# Altium schematic sheet BrauV2_Buzzer.SchDoc
size 420 x 297 mm; PageSetup: Record=PageOptions|CenterHorizontal=True|CenterVertical=True|PrintScale=1.01|XCorrection=1.00|YCorrection=1.00|PrintKind=1|BorderSize=5000000|LeftOffset=0|BottomOffset=0|Orientation=2|PaperLength=1000|PaperWidth=1000|Scale=100|PaperSource=7|PrintQuality=-4|MediaType=1|DitherType=10|PaperKind=A3|PrintScaleMode=1; DocumentNumber: 18; SheetNumber: 18; SheetTotal: 22
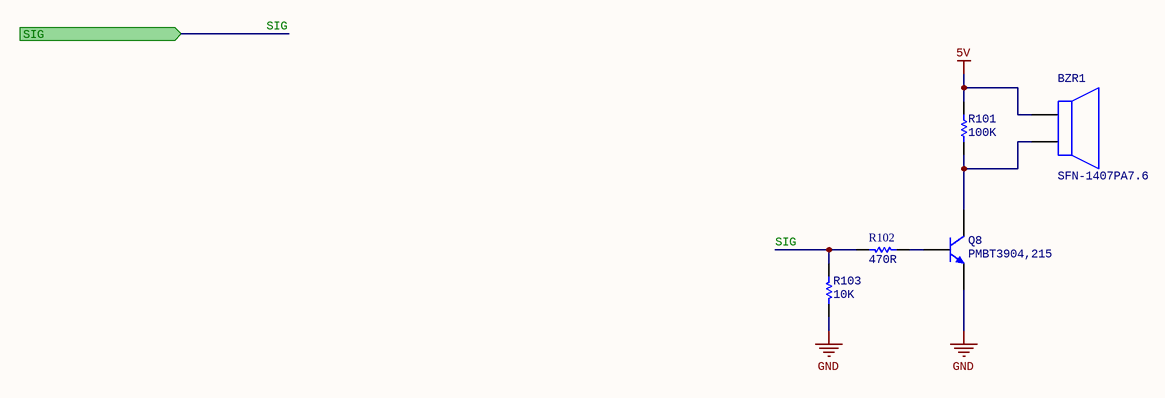
[diagram p0: BrauV2_Buzzer.SchDoc]

## Parts
BZR1  SFN-1407PA7.6  [SFN-1407PA7.6]
Q8  PMBT3904,215  [SOT23-3]
R101  Resistance: 100K  [SMD_RES_0402(1005)_N]  (hidden comment: RC0402FR-07100KL)
R102  Resistance: 470R  [SMD_RES_0402(1005)_N]  (hidden comment: RC0402FR-07470RL)
R103  Resistance: 10K  [SMD_RES_0402(1005)_N]  (hidden comment: RC0402FR-0710KL)

## Ports
SIG (in)

## Nets
5V: BZR1.1 R101.2
GND: Q8.2(E) R103.1
SIG: R102.1 R103.2 ; port SIG
NetBZR1_2: BZR1.2 Q8.3(C) R101.1
NetQ8_1: Q8.1(B) R102.2

## Notes on the sheet
- FILE NAME
- PROJECT
- TITLE
- REV
- AUTHOR
- SIZE
- SHEET
- DATE
- OF
- A3

## Library data of the parts
BZR1 = SFN-1407PA7.6: Piezo YES 3300±500Hz 85dB @ 24V, 10cm 24V Φ23.5mm Through Hole Buzzers RoHS
Q8 = PMBT3904,215: NPN 200mA 40V 250mW SOT-23(SOT-23-3) Transistors (NPN/PNP) RoHS
R101 = 100K 0402 1% 1/16W: 100kΩ ±1% 1/16W ±100ppm/℃ 0402 Chip Resistor - Surface Mount RoHS; Package: 0402; Tolerance: 1%; Power Rating: 1/16W
R102 = 470R 0402 1% 1W: 470Ω ±1% 1/16W ±100ppm/℃ 0402 Chip Resistor - Surface Mount RoHS; Power Rating: 1W; Package: 0402; Tolerance: 1%
R103 = 10K 0402 1% 1/16W: 10kΩ ±1% 1/16W ±100ppm/℃ 0402 Chip Resistor - Surface Mount RoHS; Package: 0402; Tolerance: 1%; Power Rating: 1/16W